# EAGLE design Trabajo4 (EAGLE 9.6.2)
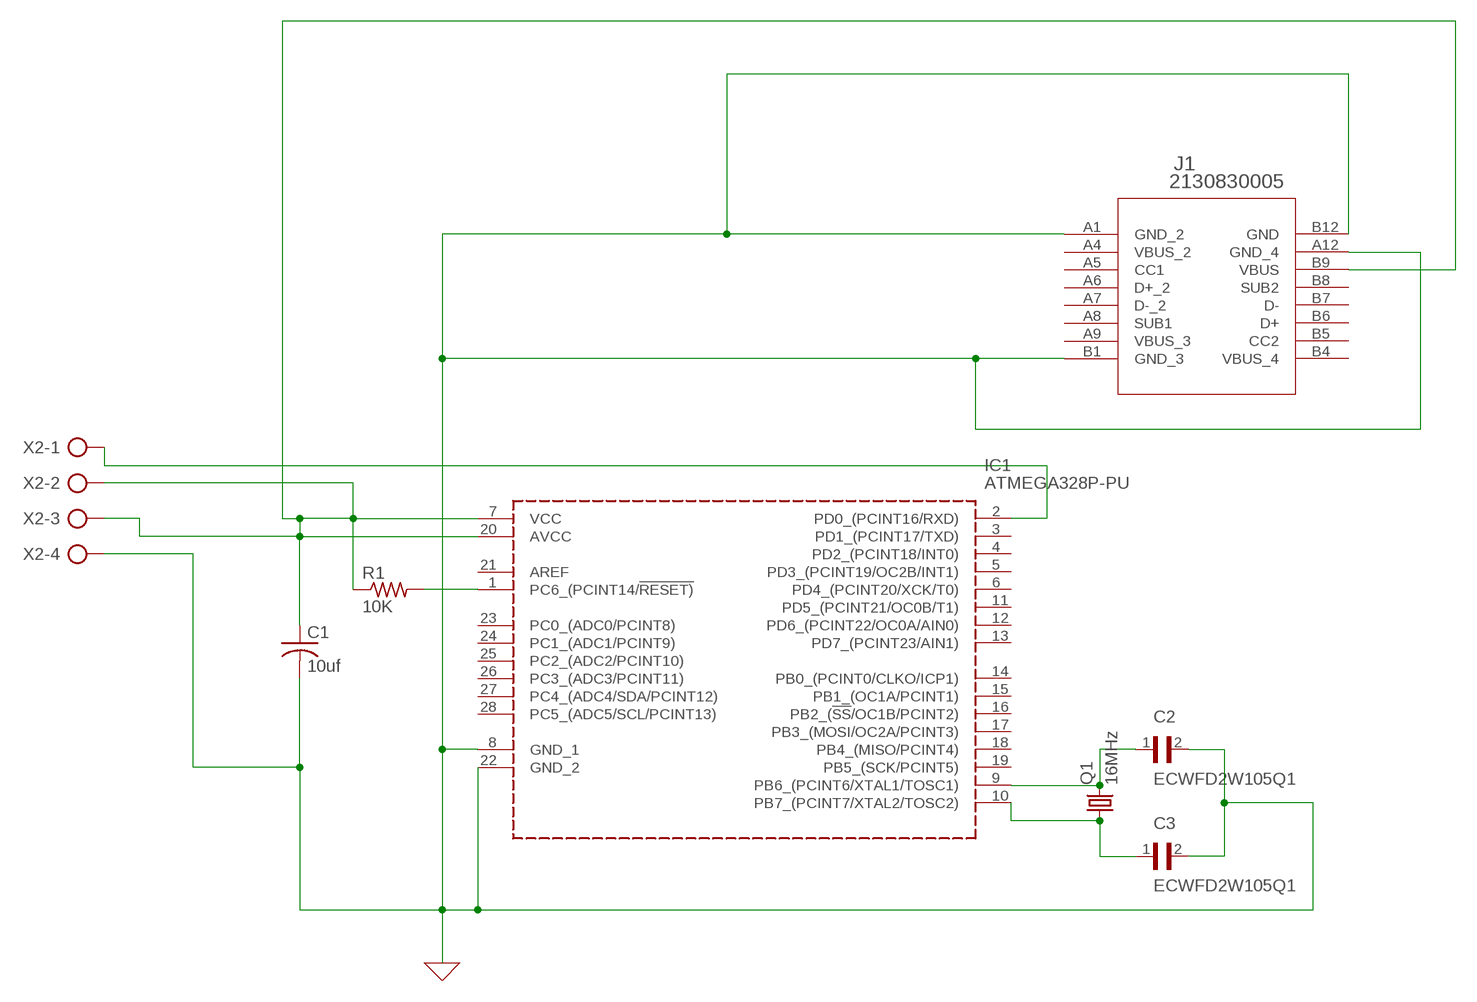
[diagram p0: schematic, sheet 1]

## Parts
C1  10uf  C-US025-024X044  [C025-024X044]
C2  ECWFD2W105Q1  [CAPRR1000W60L1260T920H1390]
C3  ECWFD2W105Q1  [CAPRR1000W60L1260T920H1390]
IC1  ATMEGA328P-PU  [DIP794W53P254L3467H457Q28N]
J1  2130830005  [2130830005_MOL]
Q1  16MHz  CRYSTALHC33U-V  [HC33U-V]
R1  10K  R-US_0204/2V  [0204V]
X2  AK500/4-H  [AK500/4-H]

## Nets
0: C1.2 C2.2 C3.2 IC1.8(GND_1) IC1.22(GND_2) J1.A1(GND_2) J1.A12(GND_4) J1.B1(GND_3) J1.B12(GND) X2.4 ; supply symbol labelled GND
N$1: C2.1 IC1.9(PB6_(PCINT6/XTAL1/TOSC1)) Q1.2
N$2: C3.1 IC1.10(PB7_(PCINT7/XTAL2/TOSC2)) Q1.1
N$3: IC1.2(PD0_(PCINT16/RXD)) X2.1
N$5: IC1.1(PC6_(PCINT14/!RESET)) R1.2
N$7: C1.1 IC1.7(VCC) IC1.20(AVCC) J1.B9(VBUS) R1.1 X2.2 X2.3
Unconnected: IC1.3(PD1_(PCINT17/TXD)) IC1.4(PD2_(PCINT18/INT0)) IC1.5(PD3_(PCINT19/OC2B/INT1)) IC1.6(PD4_(PCINT20/XCK/T0)) IC1.11(PD5_(PCINT21/OC0B/T1)) IC1.12(PD6_(PCINT22/OC0A/AIN0)) IC1.13(PD7_(PCINT23/AIN1)) IC1.14(PB0_(PCINT0/CLKO/ICP1)) IC1.15(PB1_(OC1A/PCINT1)) IC1.16(PB2_(!SS!/OC1B/PCINT2)) IC1.17(PB3_(MOSI/OC2A/PCINT3)) IC1.18(PB4_(MISO/PCINT4)) IC1.19(PB5_(SCK/PCINT5)) IC1.21(AREF) IC1.23(PC0_(ADC0/PCINT8)) IC1.24(PC1_(ADC1/PCINT9)) IC1.25(PC2_(ADC2/PCINT10)) IC1.26(PC3_(ADC3/PCINT11)) IC1.27(PC4_(ADC4/SDA/PCINT12)) IC1.28(PC5_(ADC5/SCL/PCINT13)) J1.A5(CC1) J1.A6(D+_2) J1.A7(D-_2) J1.A8(SUB1) J1.B5(CC2) J1.B6(D+) J1.B7(D-) J1.B8(SUB2)

## Power pins joined to a net without a drawn wire
VBUS_2: J1.A4(VBUS_2)
VBUS_3: J1.A9(VBUS_3)
VBUS_4: J1.B4(VBUS_4)

## Library data of the parts
C1 = rcl:C-US: CAPACITOR, American symbol; SPICEPREFIX: C
C2 = ECWFD2W105Q1:ECWFD2W105Q1: Check availability <https://pricing.snapeda.com/parts/ECWFD2W105Q1/Panasonic/view-part?ref=eda>; AVAILABILITY: In Stock; C2: 22Pf; CHECK_PRICES: https://www.snapeda.com/parts/ECWFD2W105Q1/Panasonic/view-part/?ref=eda; DESCRIPTION: Metallized Polypropylene Film Capacitor; MF: Panasonic; MP: ECWFD2W105Q1; PACKAGE: RADIAL-2 Panasonic; PRICE: None; PURCHASE-URL: https://www.snapeda.com/api/url_track_click_mouser/?unipart_id=5786160&manufacturer=Panasonic&part_name=ECWFD2W105Q1&search_term=capacitor; SNAPEDA_LINK: https://www.snapeda.com/parts/ECWFD2W105Q1/Panasonic/view-part/?ref=snap
C3 = ECWFD2W105Q1:ECWFD2W105Q1: Check availability <https://pricing.snapeda.com/parts/ECWFD2W105Q1/Panasonic/view-part?ref=eda>; AVAILABILITY: In Stock; C3: 22Pf; CHECK_PRICES: https://www.snapeda.com/parts/ECWFD2W105Q1/Panasonic/view-part/?ref=eda; DESCRIPTION: Metallized Polypropylene Film Capacitor; MF: Panasonic; MP: ECWFD2W105Q1; PACKAGE: RADIAL-2 Panasonic; PRICE: None; PURCHASE-URL: https://www.snapeda.com/api/url_track_click_mouser/?unipart_id=5786160&manufacturer=Panasonic&part_name=ECWFD2W105Q1&search_term=capacitor; SNAPEDA_LINK: https://www.snapeda.com/parts/ECWFD2W105Q1/Panasonic/view-part/?ref=snap
IC1 = ATMEGA328P-PU:ATMEGA328P-PU: Check availability <https://pricing.snapeda.com/parts/ATMEGA328PPU/Microchip%20Technology/view-part?ref=eda>; AVAILABILITY: In Stock; CHECK_PRICES: https://www.snapeda.com/parts/ATMEGA328PPU/Microchip+Technology/view-part/?ref=eda; DESCRIPTION: AVR AVR® ATmega Microcontroller IC 8-Bit 20MHz 32KB (16K x 16) FLASH 28-PDIP; MF: Microchip Technology; MP: ATMEGA328PPU; PACKAGE: None; PRICE: None; SNAPEDA_LINK: https://www.snapeda.com/parts/ATMEGA328PPU/Microchip+Technology/view-part/?ref=snap
J1 = 2130830005:2130830005: Check availability <https://pricing.snapeda.com/parts/2130830005/Molex/view-part?ref=eda>; AVAILABILITY: In Stock; CHECK_PRICES: https://www.snapeda.com/parts/2130830005/Molex/view-part/?ref=eda; DESCRIPTION: USB-C (USB TYPE-C) USB 2.0 Receptacle Connector 24 (16+8 Dummy) Position Surface Mount, Right Angle; Through Hole; MF: Molex; MP: 2130830005; PACKAGE: None; PRICE: None; PURCHASE-URL: https://www.snapeda.com/api/url_track_click_mouser/?unipart_id=5470587&manufacturer=Molex&part_name=2130830005&search_term=usb-c; SNAPEDA_LINK: https://www.snapeda.com/parts/2130830005/Molex/view-part/?ref=snap
Q1 = crystal:CRYSTAL: CRYSTAL; HOLA: 16MHZ; OC_FARNELL: unknown; OC_NEWARK: unknown
R1 = rcl:R-US_: RESISTOR, American symbol; SPICEPREFIX: R
X2 = con-ptr500:AK500/4-H: CONNECTOR Aug. 2004 / PTR Meßtechnik: Die Bezeichnung der Serie AK505 wurde geändert. Es handelt sich hierbei um AK500 in horizontaler Ausführung.; OC_FARNELL: unknown; OC_NEWARK: unknown

## Board
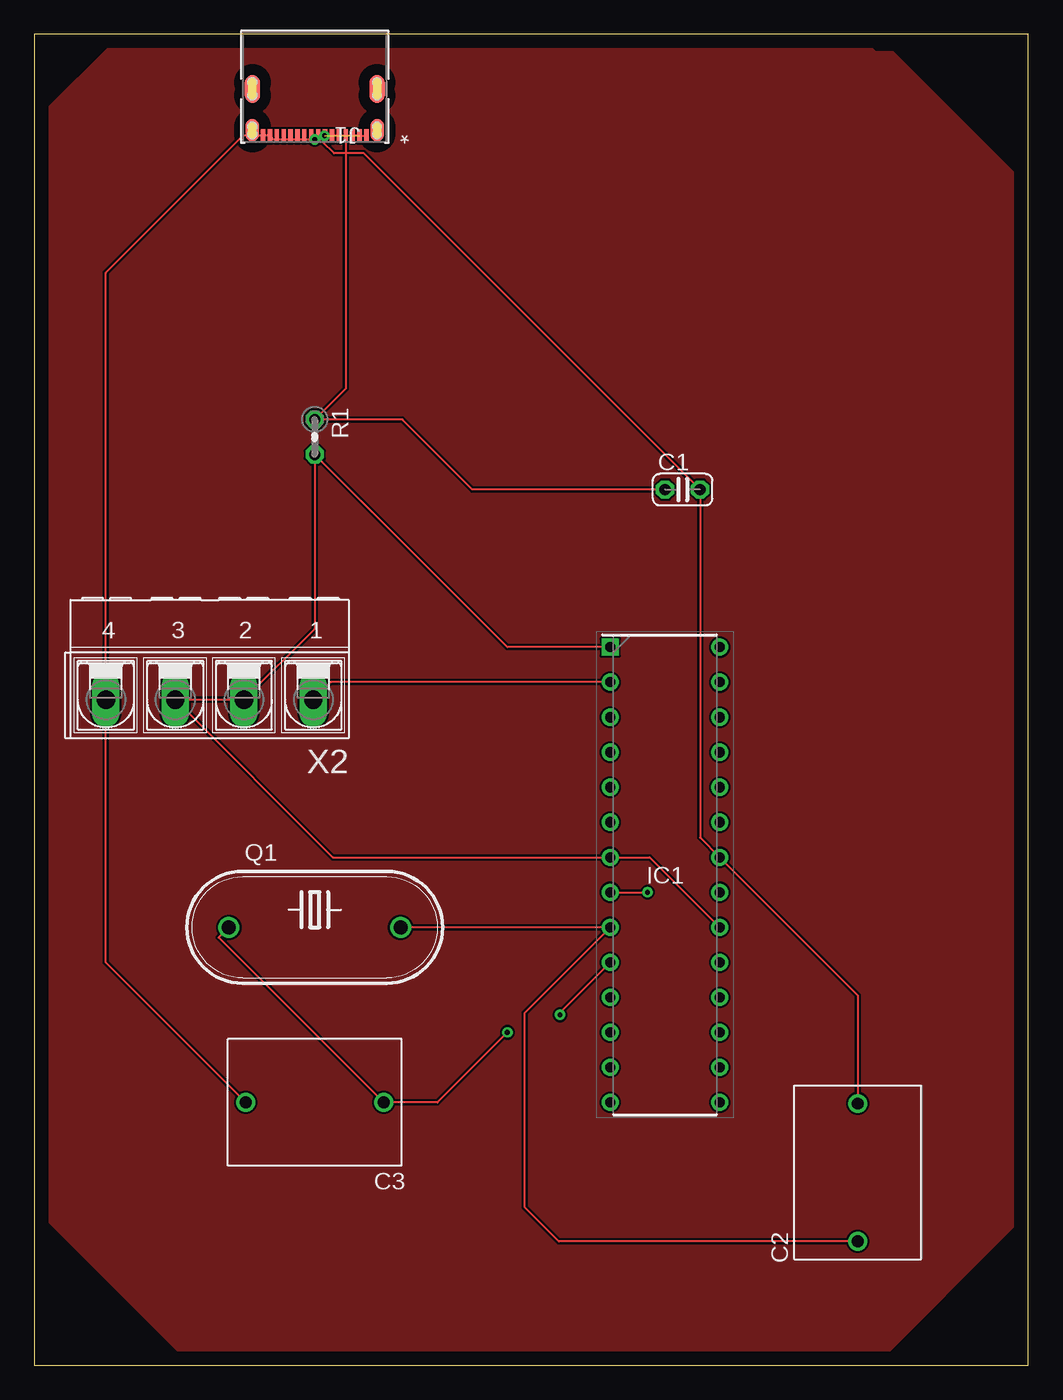
[diagram p1: board, top side]
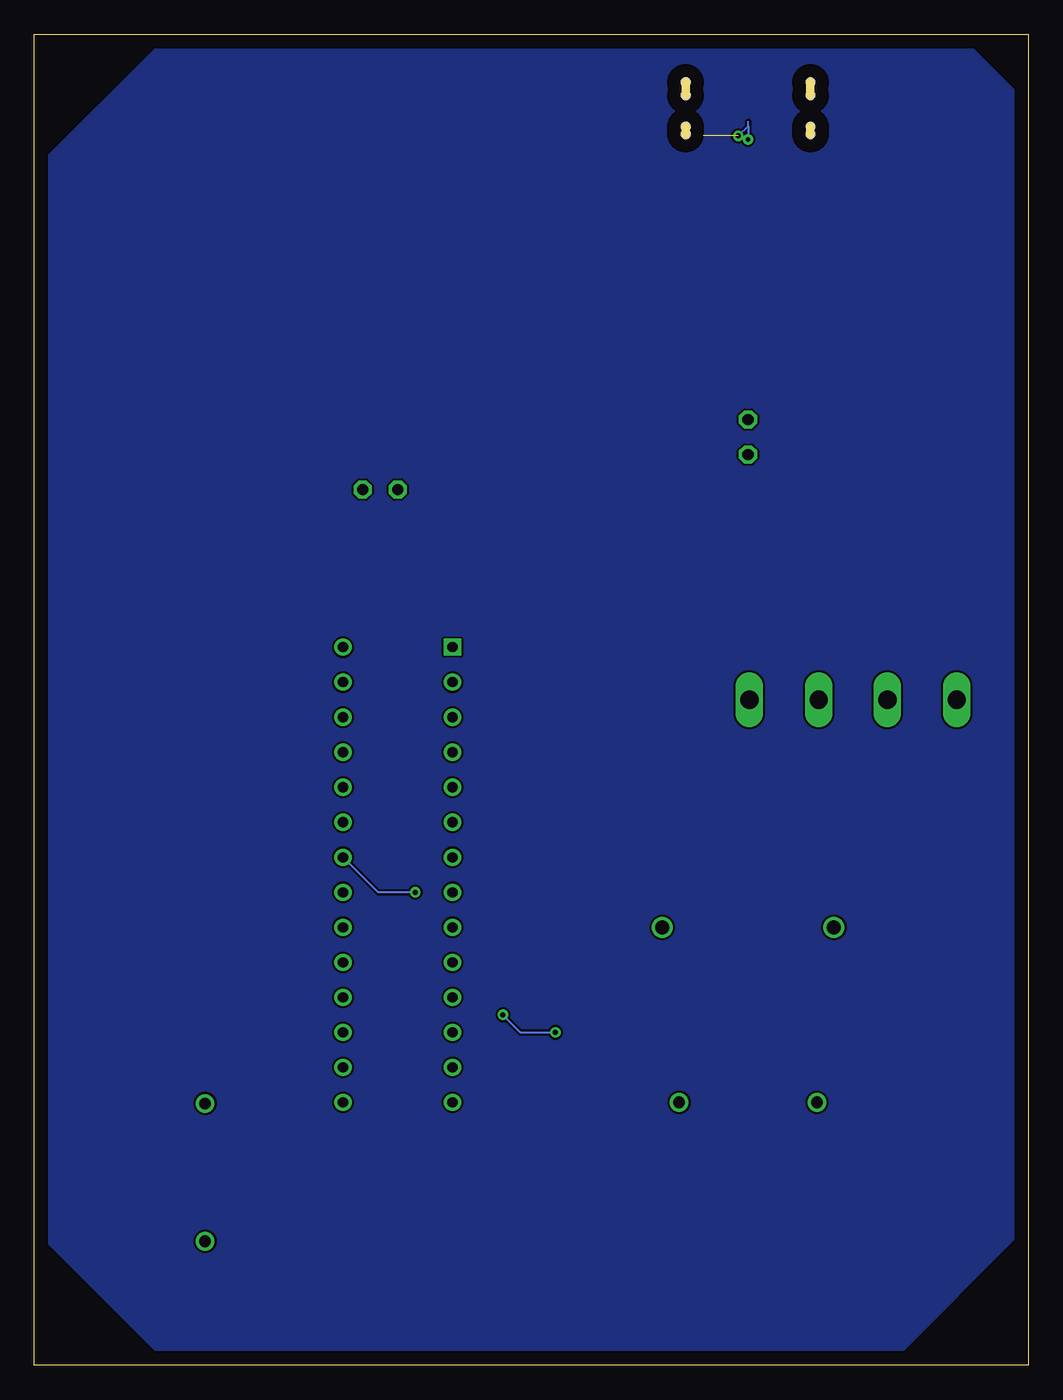
[diagram p2: board, bottom side, seen from below]

Size 72.06 x 96.51 mm. Coordinates in mm from the lower left corner, seen from the top.
Outline: 0,0 72.06,0 72.06,96.51 0,96.51 0,0
Copper layers (1*16): Top 0.035mm / dielectric 1.5mm / Bottom 0.035mm
Design rules "default": minimum track width 6mil, minimum drill 0.35mm, track to track 6mil, track to pad 6mil, pad to pad 6mil, via to via 6mil, smd to smd 6mil, copper to edge 40mil, drill to drill 6mil, minimum pad ring 10mil, minimum via ring 8mil, stop-mask expansion 4mil, vias tented up to drill 0mil, thermal gap 10mil

### Footprints (pad centres in the part's own frame; a part is rotated, then mirrored left to right if it is on the bottom)
C025-024X044 = drill 0.813 octagon: 1 -1.27,0; 2 1.27,0
CAPRR1000W60L1260T920H1390 = drill 0.85 pad 1.2: 1 -5,0; 2 5,0
DIP794W53P254L3467H457Q28N = drill 0.733 pad 1.133 square: 1 -3.969,16.51 | drill 0.733 pad 1.133: 2 -3.969,13.97; 3 -3.969,11.43; 4 -3.969,8.89; 5 -3.969,6.35; 6 -3.969,3.81; 7 -3.969,1.27; 8 -3.969,-1.27; 9 -3.969,-3.81; 10 -3.969,-6.35; 11 -3.969,-8.89; 12 -3.969,-11.43; 13 -3.969,-13.97; 14 -3.969,-16.51; 15 3.969,-16.51; 16 3.969,-13.97; 17 3.969,-11.43; 18 3.969,-8.89; 19 3.969,-6.35; 20 3.969,-3.81; 21 3.969,-1.27; 22 3.969,1.27; 23 3.969,3.81; 24 3.969,6.35; 25 3.969,8.89; 26 3.969,11.43; 27 3.969,13.97; 28 3.969,16.51
2130830005_MOL = smd 0.991 x 1.651: 17 -4.52,3.15; 18 4.52,3.15 | smd 1.092 x 2.057: 19 -4.52,0.15; 20 4.52,0.15 | smd 0.305 x 0.991: A1 -3.75,3.55; A4 -2.75,3.55; A5 -1.75,3.55; A6 -0.75,3.55; A7 0.75,3.55; A8 1.75,3.55; A9 2.75,3.55; A12 3.75,3.55; B1 3.25,3.55; B4 2.25,3.55; B5 1.25,3.55; B6 0.25,3.55; B7 -0.25,3.55; B8 -1.25,3.55; B9 -2.25,3.55; B12 -3.25,3.55 | hole 0.61: -4.521,3.429; -4.521,2.896; 4.521,3.429; 4.521,2.896; -4.521,0.61; -4.521,-0.33; 4.521,0.61; 4.521,-0.33
HC33U-V = drill 1.016: 1 -6.223,0; 2 6.223,0
0204V = drill 0.813 octagon: 1 -1.27,0; 2 1.27,0
AK500/4-H = drill 1.321 long: 1 -7.518,0; 2 -2.489,0; 3 2.489,0; 4 7.518,0

### Placement (x,y rotation side)
C1  46.99,63.5 0 top
C2  59.69,13.97 90 top
C3  20.32,19.05 180 top
IC1  45.72,35.56 0 top
J1  20.32,92.71 180 top
Q1  20.32,31.75 0 top
R1  20.32,67.31 270 top
X2  12.7,48.26 180 top

### Tracks (layer width: path | path; a pad name or v marks a point on that pad's centre or on a via)
0  (via drill 0.35)  (1 unrouted)
  Top 0.152: C3.2 5.18,29.19 X2.4 5.18,79.23 15.11,89.16 J1.B1 | IC1.8 v44.45,34.29 | C2.2 59.69,26.83 IC1.22 48.26,38.26 C1.2 23.88,87.88 21.72,87.88 20.91,88.7 21.38,89.16 J1.B12 J1.A1 | J1.B1 J1.A12 | J1.B1 17.33,88.9 v20.32,88.9
  Bottom 0.152: v44.45,34.29 47.15,34.29 IC1.22 | 20.32,89.87 v20.32,88.9 | v21.03,89.16 20.32,89.87 | 20.32,89.87 20.32,90.17
GND
  pour Top: 0,11.43 0,90.17 6.35,96.52 59.69,96.52 60.96,95.25 62.23,95.25 72.39,85.09 72.39,11.43 71.12,10.16 60.96,0 11.43,0
  pour Bottom: 10.16,0 0,10.16 0,91.44 5.08,96.52 6.35,96.52 62.23,96.52 72.39,86.36 72.39,10.16 71.12,8.89 62.23,0 60.96,0
N$1
  Top 0.152: C2.1 38.02,8.97 35.56,11.43 35.56,25.56 IC1.9 Q1.2
N$2  (via drill 0.35)
  Top 0.152: IC1.10 38.1,25.56 v38.1,25.4 | v34.29,24.13 29.21,19.05 C3.1 13.36,31.01 Q1.1
  Bottom 0.152: v38.1,25.4 36.83,24.13 v34.29,24.13
N$3
  Top 0.152: IC1.2 21.49,49.53 X2.1
N$5
  Top 0.152: IC1.1 34.29,52.07 R1.2
N$7
  Top 0.152: IC1.20 44.61,36.83 IC1.7 21.64,36.83 X2.3 X2.2 20.32,53.39 R1.1 | C1.1 31.75,63.5 26.67,68.58 R1.1 | J1.B9 22.57,70.83 R1.1